# EAGLE design Vibration (EAGLE 7.3.0)
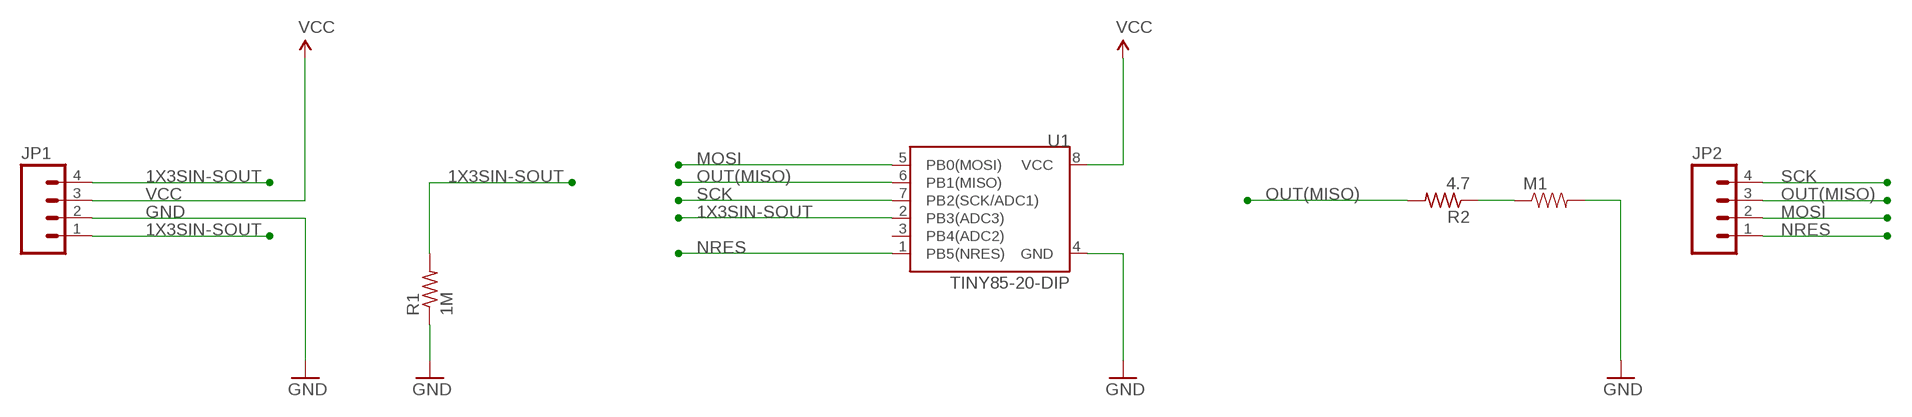
[diagram p0: schematic, sheet 1]

## Parts
JP1  M04PTH  [1X04]
JP2  M04PTH  [1X04]
M1  10OHM-1/4W-5%(PTH)VERT-KIT  [AXIAL-0.1EZ]
R1  1M  R-US_R0603  [R0603]
R2  4.7  R-US_R0603  [R0603]
U1  TINY85-20-DIP  ATTINY45TINY85-20-DIP  [DIP08]

## Nets
1X3SIN-SOUT: JP1.1 JP1.4 R1.2 U1.2(PB3(ADC3))
GND: JP1.2 M1.P$2 R1.1 U1.4(GND)
MOSI: JP2.2 U1.5(PB0(MOSI))
N$1: M1.P$1 R2.1
NRES: JP2.1 U1.1(PB5(NRES))
OUT(MISO): JP2.3 R2.2 U1.6(PB1(MISO))
SCK: JP2.4 U1.7(PB2(SCK/ADC1))
VCC: JP1.3 U1.8(VCC)
Unconnected: U1.3(PB4(ADC2))

## Library data of the parts
JP1 JP2 = SparkFun-Connectors:M04: Header 4 Standard 4-pin 0.1" header. Use with straight break away headers (SKU : PRT-00116), right angle break away headers (PRT-00553), swiss pins (PRT-00743), machine pins (PRT-00117), and female headers (PRT-00115). Molex polarized connector foot print use with SKU : PRT-08231 with associated crimp pins and housings. 1MM SMD Version SKU: PRT-10208
M1 = SparkFun-Resistors:10OHM-1/4W-5%(PTH): RES-10698; PROD_ID: RES-10698; VALUE: 10
R1 R2 = adafruit:R-US_: RESISTOR, American symbol
U1 = SparkFun-DigitalIC:ATTINY45: Atmel 8-pin 2/4/8kB flash uC; PROD_ID: IC-09445

## Board
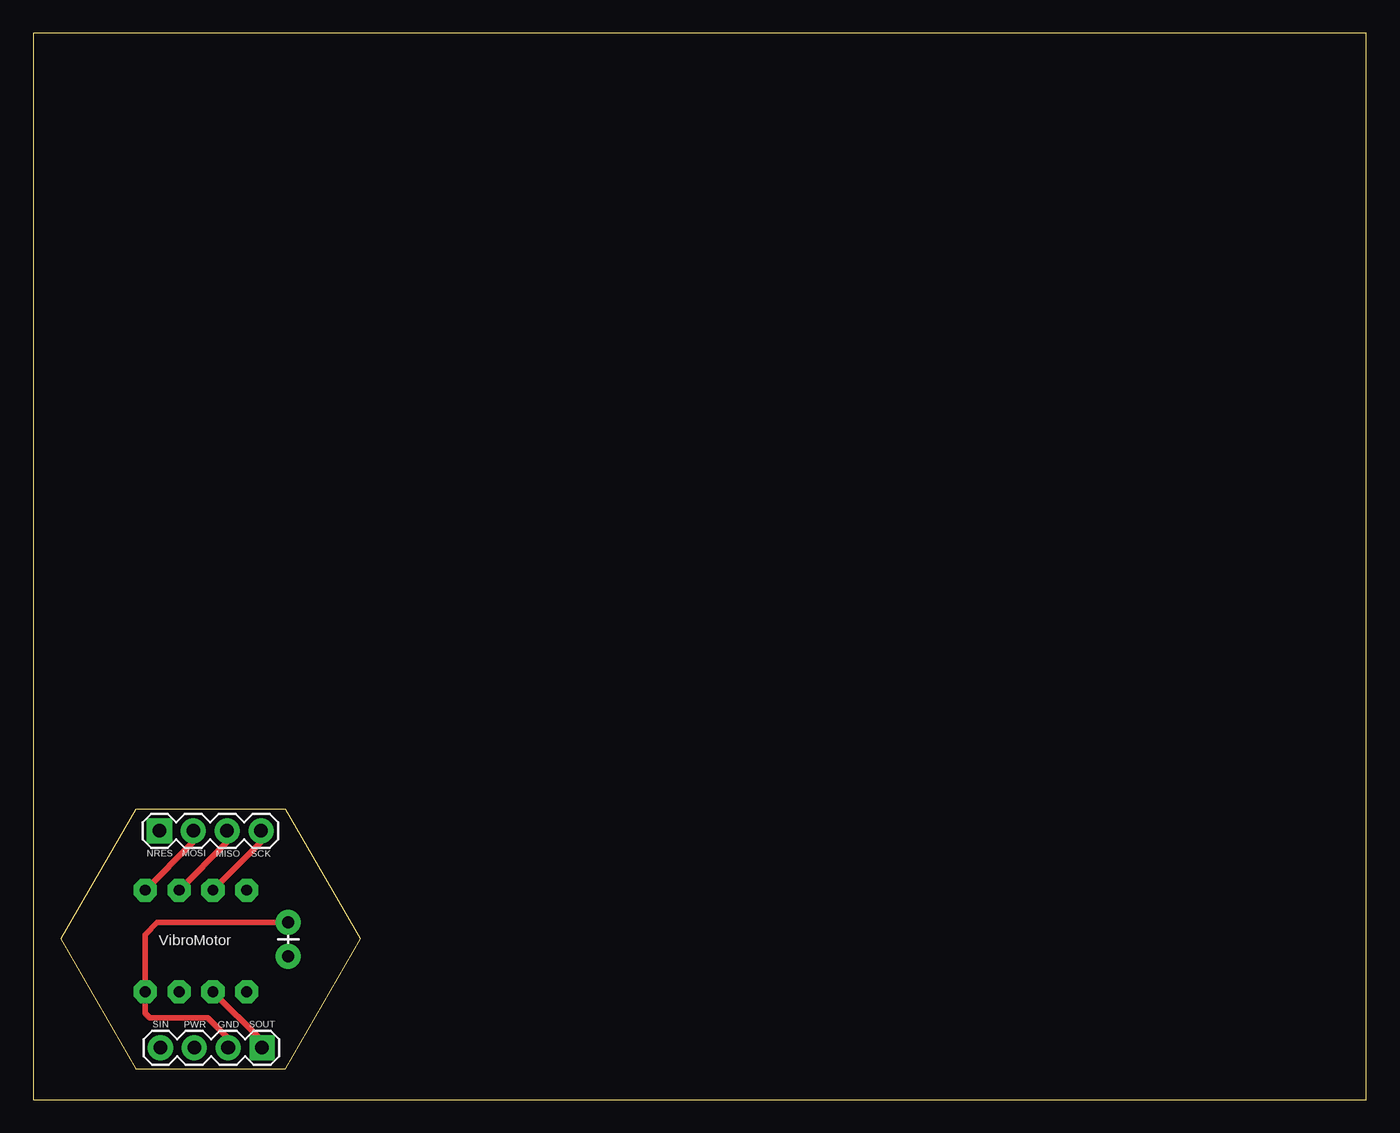
[diagram p1: board, top side]
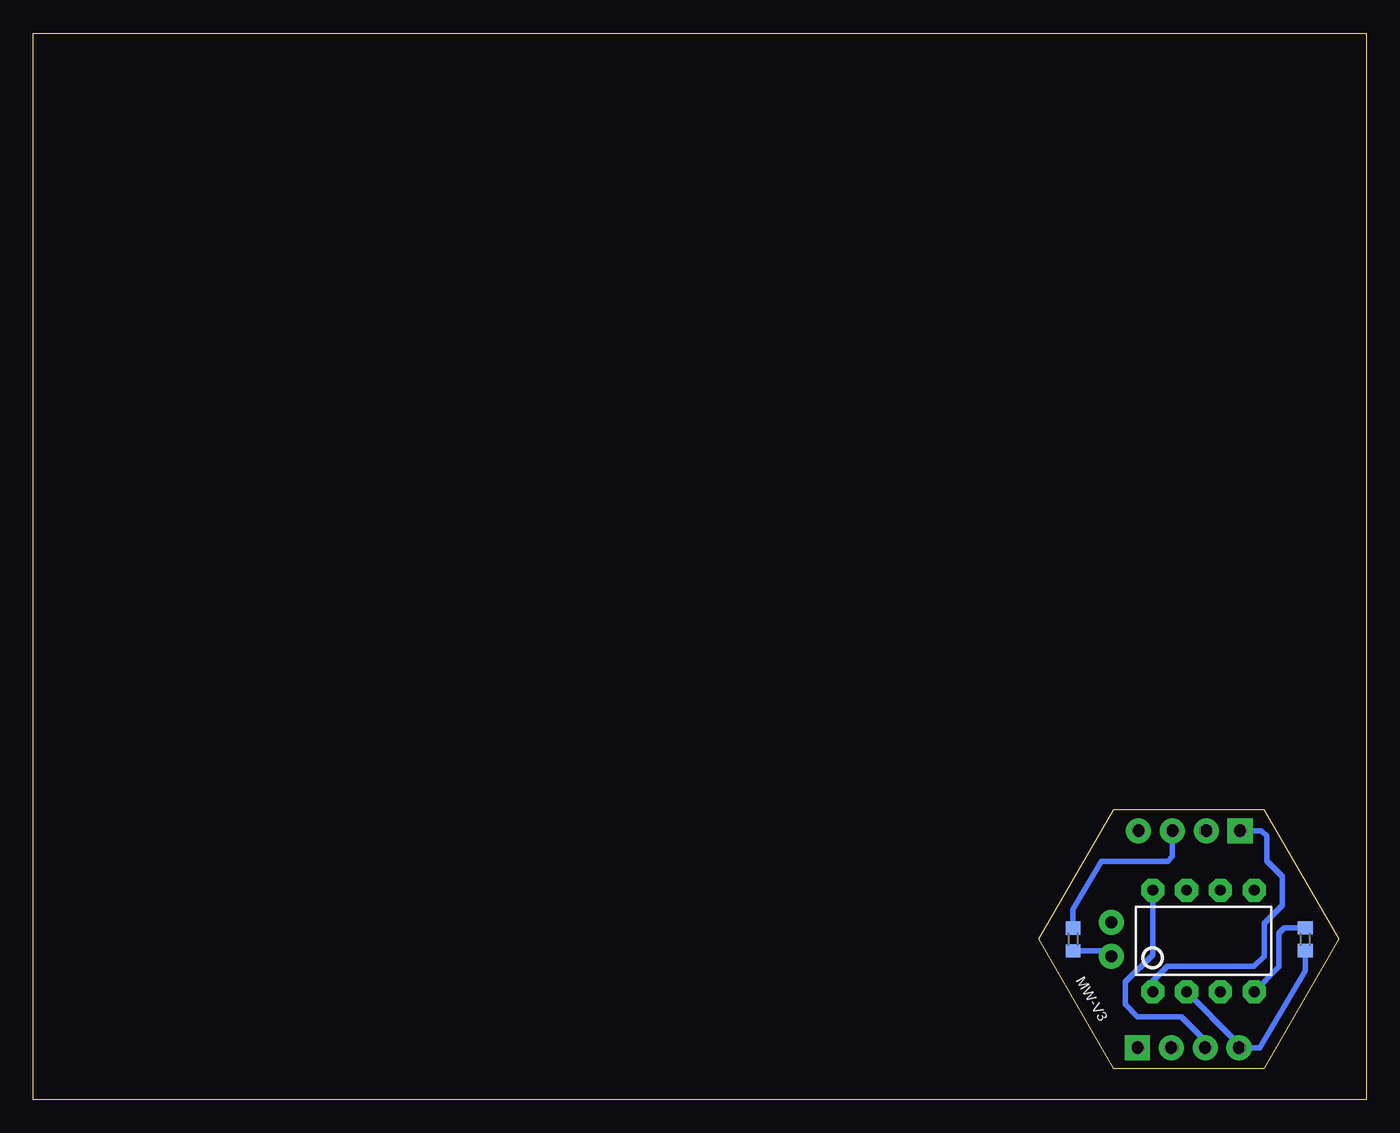
[diagram p2: board, bottom side, seen from below]

Size 100 x 80 mm. Coordinates in mm from the lower left corner, seen from the top.
Outline: 0,0 100,0 100,80 0,80 0,0
Outline: 7.69,2.3 18.94,2.3 24.56,12.04 18.94,21.78 7.69,21.78 2.06,12.04 7.69,2.3
Copper layers (1*16): Top 0.035mm / dielectric 1.5mm / Bottom 0.035mm
Design rules "default *": minimum track width 10mil, minimum drill 24mil, track to track 8mil, track to pad 8mil, pad to pad 8mil, via to via 8mil, smd to smd 8mil, copper to edge 0mil, drill to drill 8mil, minimum pad ring 10mil, minimum via ring 8mil, stop-mask expansion 4mil, vias tented up to drill 0mil, thermal gap 10mil

### Footprints (pad centres in the part's own frame; a part is rotated, then mirrored left to right if it is on the bottom)
1X04 = drill 1.016 pad 1.88 square: 1 0,0 | drill 1.016 pad 1.88: 2 2.54,0; 3 5.08,0; 4 7.62,0
AXIAL-0.1EZ = drill 0.9 pad 1.88: P$1 0,0; P$2 2.54,0
R0603 = smd 1 x 1.1: 1 -0.85,0; 2 0.85,0
DIP08 = drill 0.813 pad 1.727 octagon: 1 -3.81,-3.81; 2 -1.27,-3.81; 3 1.27,-3.81; 4 3.81,-3.81; 5 3.81,3.81; 6 1.27,3.81; 7 -1.27,3.81; 8 -3.81,3.81

### Placement (x,y rotation side)
JP1  17.16,3.89 180 top
JP2  9.46,20.17 0 top
M1  19.13,10.76 90 top
R1  4.57,12.03 270 bottom
R2  22,12 90 bottom
U1  12.2,11.9 0 bottom

### Tracks (layer width: path | path; a pad name or v marks a point on that pad's centre or on a via)
1X3SIN-SOUT
  Top 0.4: U1.2 17.08,4.48 17.08,3.96 JP1.1
  Bottom 0.4: U1.2 13.47,8.08 9.82,4.42 9.82,4.17 JP1.4 7.99,3.89 4.57,9.65 R1.2
GND
  Top 0.4: JP1.2 14.62,4.61 13.08,6.15 8.72,6.15 8.39,6.48 8.39,7.53 | 8.39,7.53 U1.4 | M1.P$2 9.31,13.3 8.38,12.37 8.38,7.54 8.39,7.53
  Bottom 0.4: R1.1 6.15,12.88 6.54,12.48 6.54,9.94 U1.4
MOSI
  Top 0.4: JP2.2 12,19.32 U1.5
N$1
  Bottom 0.4: R2.1 19.52,11.15 M1.P$1
NRES
  Bottom 0.4: JP2.1 7.86,20.17 7.47,19.77 7.47,17.91 6.3,16.74 6.3,14.57 7.66,13.21 7.66,10.76 8.42,9.99 14.91,9.99 16.05,8.85 16.05,8.13 U1.1
OUT(MISO)
  Top 0.4: JP2.3 14.54,19.32 U1.6
  Bottom 0.4: R2.2 22,14.26 22.01,14.28 19.88,17.88 14.9,17.88 14.53,18.25 14.53,20.16 JP2.3
SCK
  Top 0.4: JP2.4 17.08,19.32 U1.7
VCC
  Bottom 0.4: U1.8 16.02,10.87 18.07,8.81 18.07,7.14 17.16,6.22 13.86,6.22 12.09,4.46 JP1.3

### Text on the board
tPlace: NRES | MOSI | MISO | SCK | VibroMotor | SIN | PWR | GND | SOUT
bPlace: MW-V3